# Altium schematic sheet 电机驱动.SchDoc
size A4
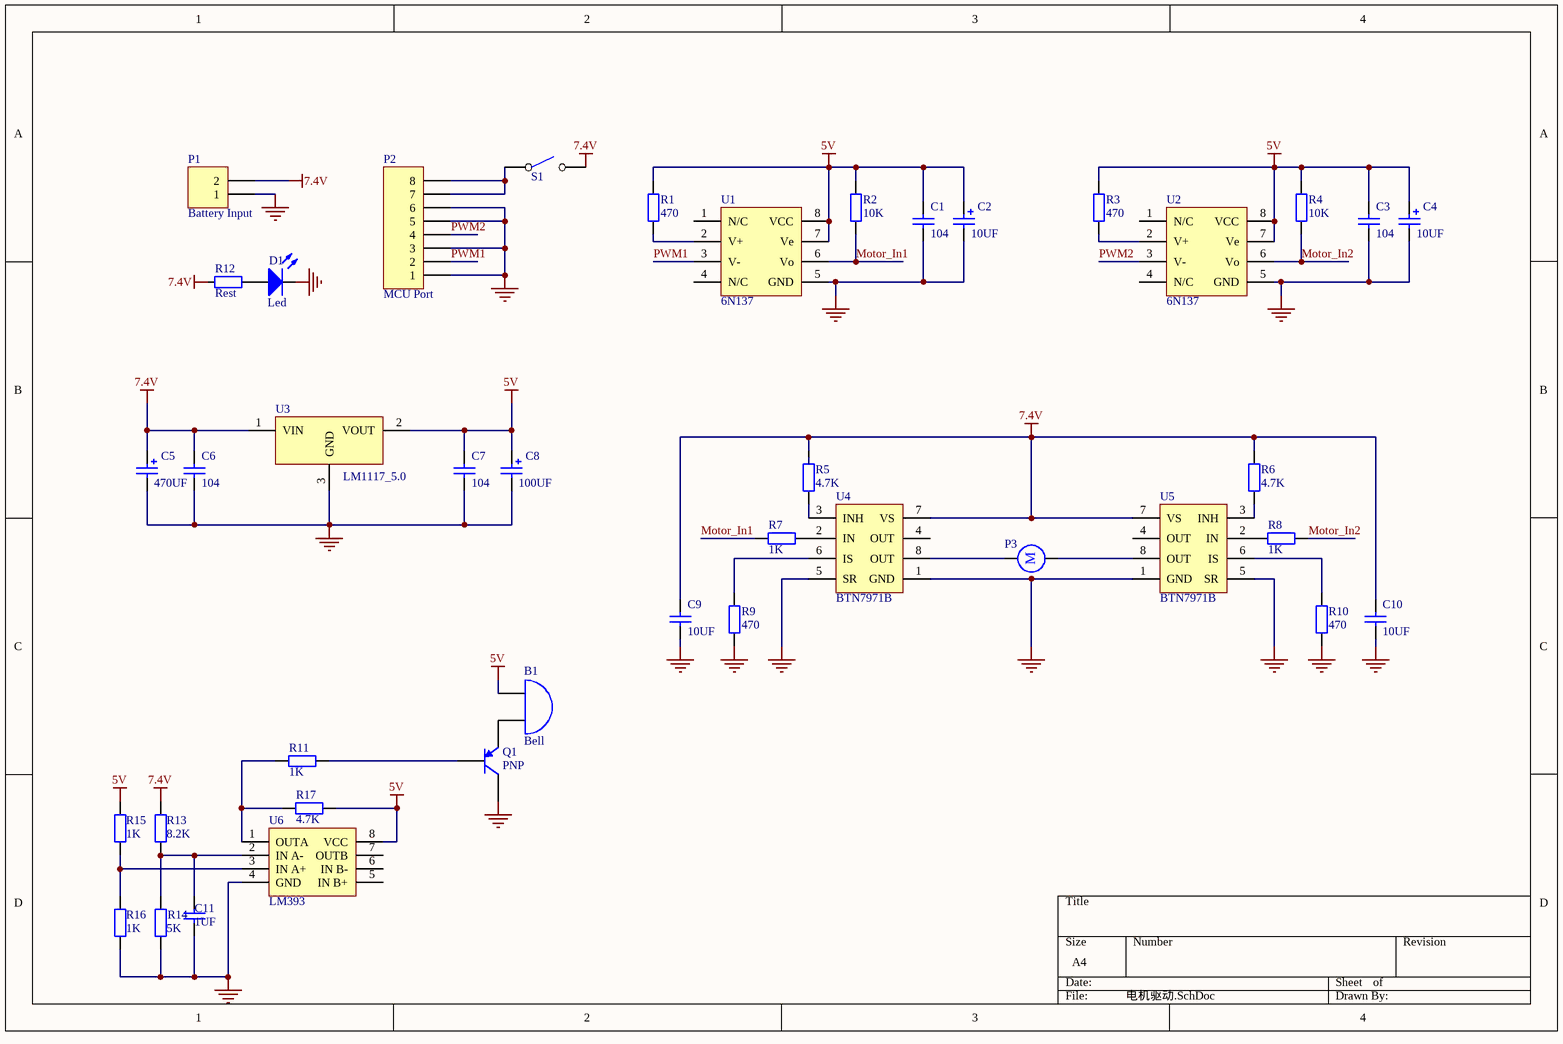
[diagram p0: 电机驱动.SchDoc]

## Parts
B1  Bell  [Buzzer]
C1  104  [0805]
C2  10UF  [tiepian 100uf 6*7]
C3  104  [0805]
C4  10UF  [tiepian 100uf 6*7]
C5  470UF  [tie pian 470uf 10*10.3]
C6  104  [0805]
C7  104  [0805]
C8  100UF  [tiepian 100uf 6*7]
C9  10UF  [7343]
C10  10UF  [7343]
C11  1UF  [0805]
D1  Led  [0805]
P1  Battery Input  [XT-30]
P2  MCU Port  [8P-2.54]
P3  Motor  [接头10MM]  (value not drawn)
Q1  PNP  [SOT-23]
R1  470  [0805]
R2  10K  [0805]
R3  470  [0805]
R4  10K  [0805]
R5  4.7K  [0805]
R6  4.7K  [0805]
R7  1K  [0805]
R8  1K  [0805]
R9  470  [0805]
R10  470  [0805]
R11  1K  [0805]
R12  Rest  [0805]
R13  8.2K  [0805]
R14  5K  [0805]
R15  1K  [0805]
R16  1K  [0805]
R17  4.7K  [0805]
S1  单刀开关  [钮子开关]  (value not drawn)
U1  6N137  [6N137]
U2  6N137  [6N137]
U3  LM1117_5.0  [SOT-223]
U4  BTN7971B  [BTN7971B]
U5  BTN7971B  [BTN7971B]
U6  LM393  [SOP-8]

## Nets
5V: B1.1(A) C1.2 C2.1 C3.2 C4.1 C7.2 C8.1 R1.2 R2.2 R3.2 R4.2 R15.2 R17.1 U1.7(Ve) U1.8(VCC) U2.7(Ve) U2.8(VCC) U3.2(VOUT) U6.8(VCC)
7.4V: C5.1 C6.2 C9.2 C10.2 P1.2 R5.2 R6.2 R13.2 S1.2 U3.1(VIN) U4.7(VS) U5.7(VS)
GND: C1.1 C2.2 C3.1 C4.2 C5.2 C6.1 C7.1 C8.2 C9.1 C10.1 C11.1 D1.2 P1.1 P2.1 P2.3 P2.5 P2.6 Q1.1(C) R9.1 R10.1 R14.1 R16.1 U1.5(GND) U2.5(GND) U3.3(GND) U4.1(GND) U4.5(SR) U5.1(GND) U5.5(SR) U6.4(GND)
Motor_In1: R2.1 R7.2 U1.6(Vo)
Motor_In2: R4.1 R8.1 U2.6(Vo)
PWM1: P2.2 U1.3(V-)
PWM2: P2.4 U2.3(V-)
NetB1_2: B1.2(B) Q1.3(E)
NetC11_2: C11.2 R13.1 R14.2 U6.2(IN_A-)
NetD1_1: D1.1 R12.2
NetP2_7: P2.7 P2.8 S1.1
NetP3_1: P3.1 U4.8(OUT)
NetP3_2: P3.2 U5.8(OUT)
NetQ1_2: Q1.2(B) R11.1
NetR1_1: R1.1 U1.2(V+)
NetR3_1: R3.1 U2.2(V+)
NetR5_1: R5.1 U4.3(INH)
NetR6_1: R6.1 U5.3(INH)
NetR7_1: R7.1 U4.2(IN)
NetR8_2: R8.2 U5.2(IN)
NetR9_2: R9.2 U4.6(IS)
NetR10_2: R10.2 U5.6(IS)
NetR11_2: R11.2 R17.2 U6.1(OUTA)
NetR15_1: R15.1 R16.2 U6.3(IN_A+)

Not connected (* = marked no-connect by the designer): R12 1; U1 1(N/C) 4(N/C); U2 1(N/C) 4(N/C); U4 4(OUT); U5 4(OUT); U6 5(IN_B+) 6(IN_B-) 7(OUTB)

## Notes on the sheet
- Labels drawn without touching a wire or pin: 7.4V
- (in symbol Motor) M

## Library data of the parts
B1 = Bell: Electrical Bell; Published: 24-Mar-1999; LatestRevisionDate: 17-Jul-2002; LatestRevisionNote: Re-released for DXP Platform.; PackageReference: PIN2; Publisher: Altium Limited
C1 C3 C6 C7 C9-C11 = Cap
C2 C4 C5 C8 = Cap Pol1
P1 = Header 2: Header, 2-Pin; LatestRevisionDate: 17-Jul-2002; LatestRevisionNote: Re-released for DXP Platform.; Publisher: Altium Limited
P2 = Header 8: Header, 8-Pin; LatestRevisionDate: 17-Jul-2002; LatestRevisionNote: Re-released for DXP Platform.; Publisher: Altium Limited
Q1 = PNP: PNP Bipolar Transistor; Published: 8-Jun-2000; LatestRevisionDate: 29-May-2009; LatestRevisionNote: IPC-7351 Footprint Added.; PackageVersion: Aug-1999; PackageReference: SOT-23B; Publisher: Altium Limited; PackageDescription: 3-Pin SOT-23 Package 0.95 mm Pitch, 2.4 mm Lead Span
R1-R11 R13-R17 = Rest
U3 = LM1117_5V